# EAGLE design GNS 902 Carrier Board (EAGLE 7.4.0)
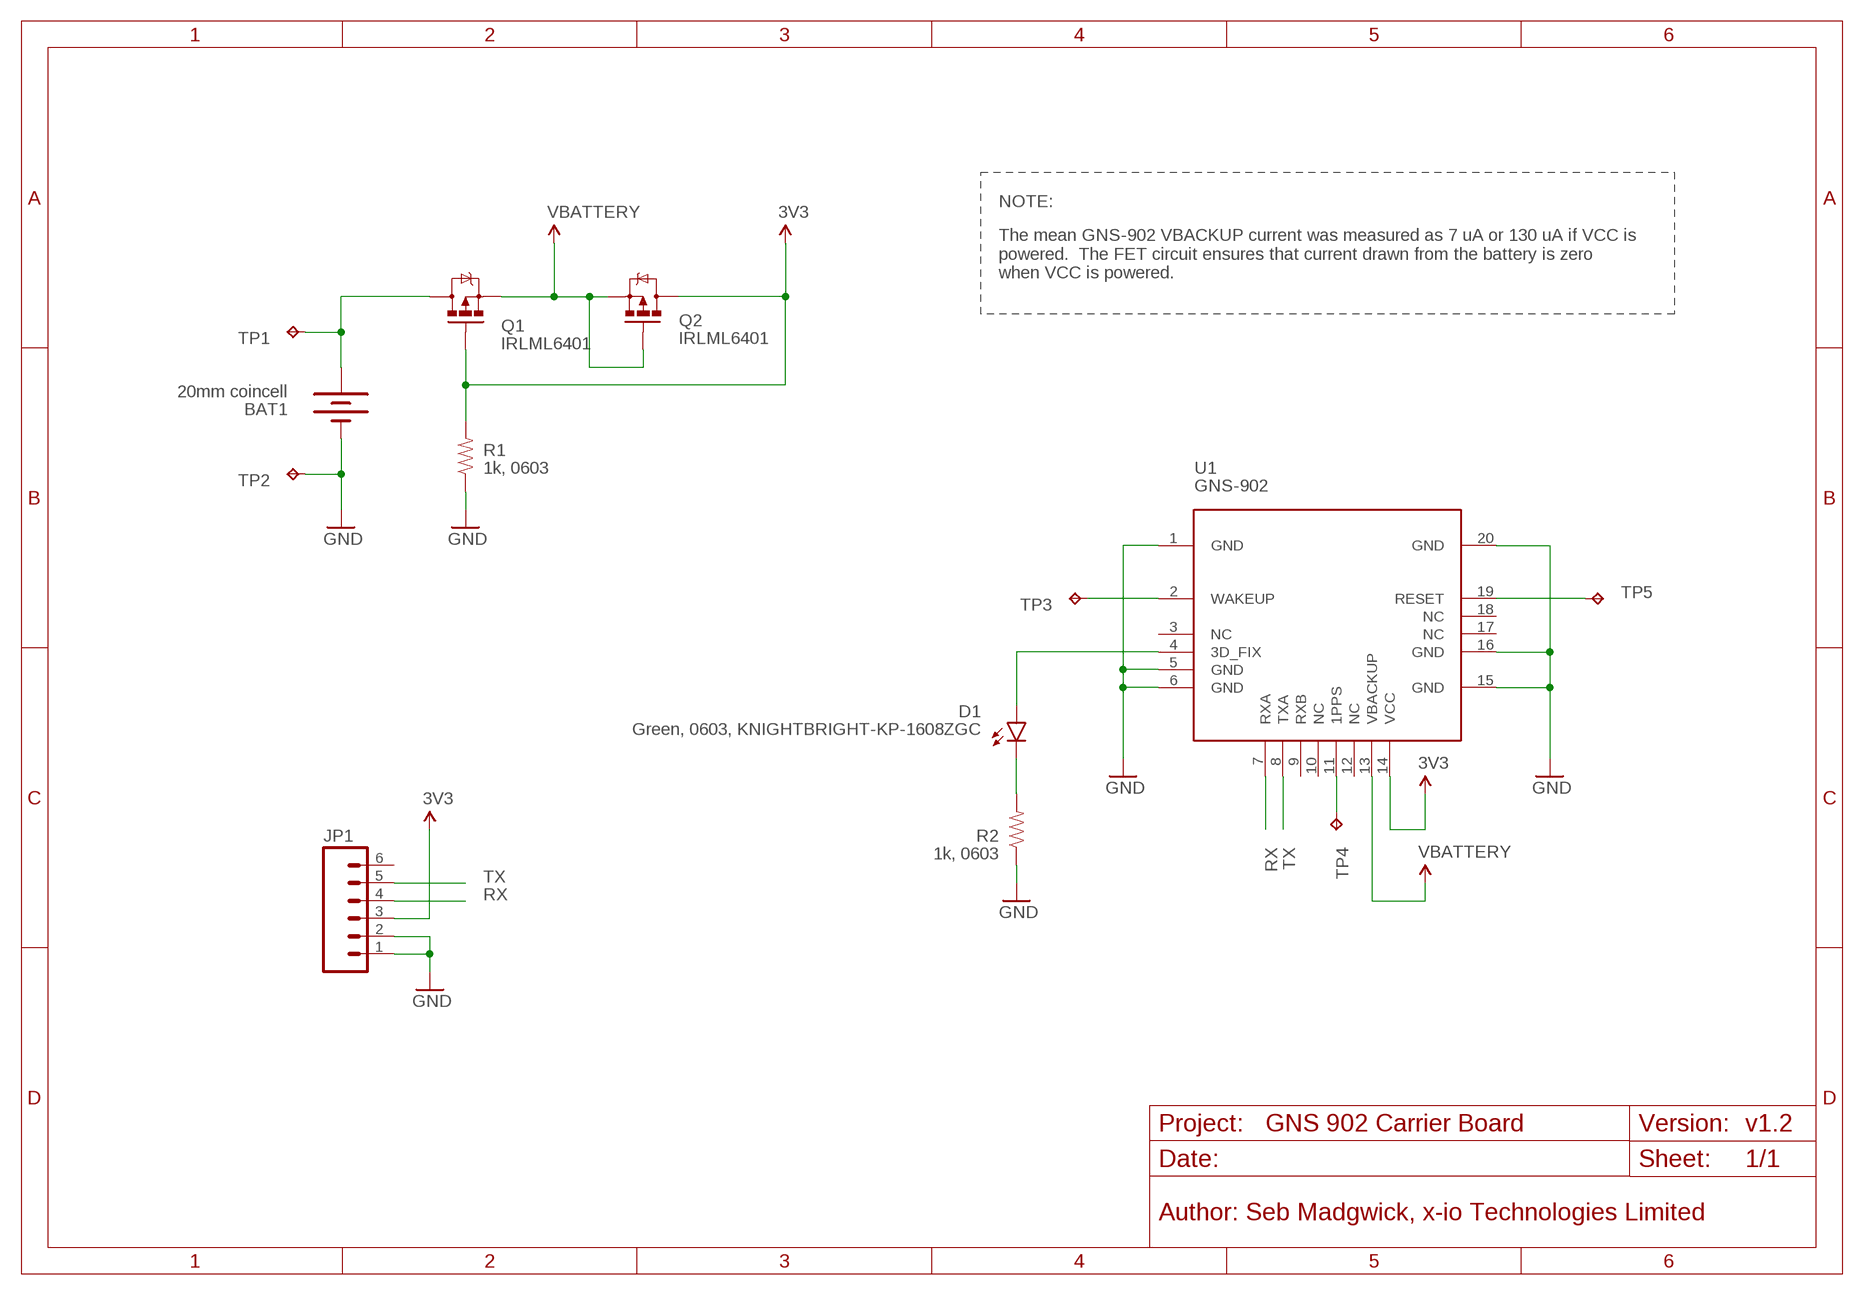
[diagram p0: schematic, sheet 1]

## Parts
BAT1  20mm coincell  BATTERY20MM_4LEGS  [BATTCON_20MM_4LEGS]
D1  Green, 0603, KNIGHTBRIGHT-KP-1608ZGC  LED0603  [LED-0603]
JP1  M06NO_SILK_FEMALE_PTH  [1X06_NO_SILK]
Q1  IRLML6401  MOSFET-PCHANNEL  [SOT23-3]
Q2  IRLML6401  MOSFET-PCHANNEL  [SOT23-3]
R1  1k, 0603  RESISTOR0603  [0603-RES]
R2  1k, 0603  RESISTOR0603  [0603-RES]
TP1  TPTP15R  [TP15R]
TP2  TPTP15R  [TP15R]
TP3  TPTP10R  [TP10R]
TP4  TPTP10R  [TP10R]
TP5  TPTP10R  [TP10R]
U1  GNS-902  [GNS-902]

## Nets
3V3: JP1.3 Q1.1(G) Q2.3(D) R1.2 U1.14(VCC)
GND: BAT1.2(-) JP1.1 JP1.2 R1.1 R2.1 TP2.TP U1.1(GND) U1.5(GND) U1.6(GND) U1.15(GND) U1.16(GND) U1.20(GND)
N$1: D1.A U1.4(3D_FIX)
N$2: D1.C R2.2
N$3: TP3.TP U1.2(WAKEUP)
N$4: TP4.TP U1.11(1PPS)
N$5: TP5.TP U1.19(RESET)
N$6: BAT1.1(+) Q1.3(D) TP1.TP
RX: JP1.4 U1.7(RXA)
TX: JP1.5 U1.8(TXA)
VBATTERY: Q1.2(S) Q2.1(G) Q2.2(S) U1.13(VBACKUP)
Unconnected: JP1.6 U1.3(NC) U1.9(RXB) U1.10(NC) U1.12(NC) U1.17(NC) U1.18(NC)

## Notes on the sheet
- NOTE:
- The mean GNS-902 VBACKUP current was measured as 7 uA or 130 uA if VCC is
  powered.  The FET circuit ensures that current drawn from the battery is zero
  when VCC is powered.
- v1.2
- Author: Seb Madgwick, x-io Technologies Limited

## Library data of the parts
BAT1 = SparkFun-Electromechanical:BATTERY: Battery Holders Various common sizes : AA, AAA, 18650 (PRT-12895), 20mm coin cell and 12mm coin cell. 20MM_4LEGS, BATT-10373; PROD_ID: BATT-10373
D1 = SparkFun-LED:LED: LEDs Standard schematic elements and footprints for 5mm, 3mm, 1206, and 0603 sized LEDs. 5mm - Spark Fun Electronics SKU : COM-00529 (and others)
JP1 = SparkFun-Connectors:M06: Header 6 Standard 6-pin 0.1" header. Use with straight break away headers (SKU : PRT-00116), right angle break away headers (PRT-00553), swiss pins (PRT-00743), machine pins (PRT-00117), and female headers (PRT-00115). Molex polarized connector foot print use with SKU : PRT-08094 with associated crimp pins and housings. NOTES ON THE VARIANTS LOCK and LOCK_LONGPADS... This footprint was designed to help hold the alignment of a through-hole component (i.e. 6-pin header) while soldering it into place. You may notice that each hole has been shifted either up or down by 0.005 of an inch from it's more standard position (which is a perfectly straight line). This slight alteration caused the pins (the squares in the middle) to touch the edges of the holes. Because they are alternating, it causes a "brace" to hold the component in place. 0.005 has proven to be the perfect amount of "off-center" position when using our standard breakaway headers. Although looks a little odd when you look at the bare footprint, once you have a header in there, the alteration is very hard to notice. Also,if you push a header all the way into place, it is covered up entirely on the bottom side. This idea of altering the position of holes to aid alignment will be further integrated into the Sparkfun Library for other footprints. It can help hold any component with 3 or more connection pins.; PROD_ID: CONN-08437
Q1 Q2 = SparkFun-DiscreteSemi:MOSFET-PCHANNEL: Generic PMOSFET IRLML2244 - TRANS-11153 (SOT-23 -20V -4.3A) (1.Gate 2.Source 3.Drain) FQP27P06 - COM-10349 <http://www.sparkfun.com/products/10349> (TO-220 -60V -27A) (1.Gate 2.Source 3.Drain); PROD_ID: TRANS-08285
R1 R2 = SparkFun-Resistors:RESISTOR: Resistor Basic schematic elements and footprints for 0603, 1206, and PTH resistors.
TP1-TP5 = testpad:TP: Test pad
U1 = x-io:GNS-902

## Board
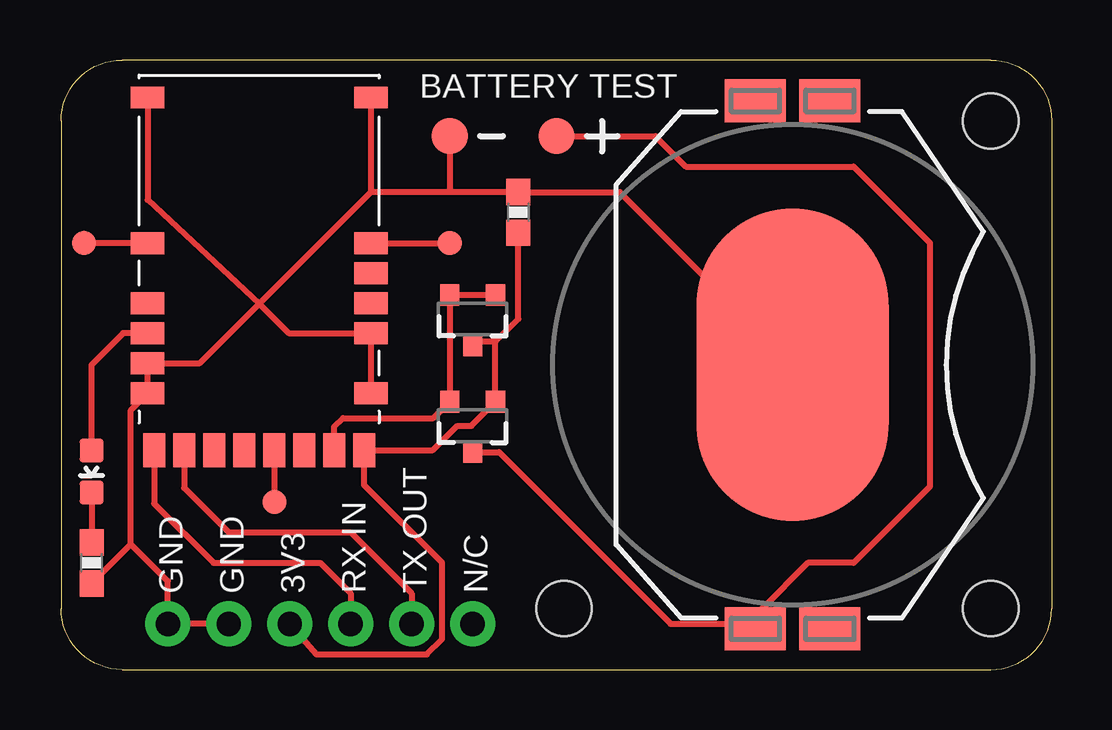
[diagram p1: board, top side]

Size 41.27 x 25.4 mm. Coordinates in mm from the lower left corner, seen from the top.
Outline: 2.54,0 38.73,0 arc90 41.27,2.54 41.27,22.86 arc90 38.73,25.4 2.54,25.4 arc90 0,22.86 0,2.54 arc90 2.54,0
Copper layers (1*16): Top 0.035mm / dielectric 1.5mm / Bottom 0.035mm
Design rules "default *": minimum track width 6mil, minimum drill 13mil, track to track 6mil, track to pad 6mil, pad to pad 6mil, via to via 6mil, smd to smd 6mil, copper to edge 15mil, drill to drill 13mil, minimum pad ring 10mil, minimum via ring 8mil, stop-mask expansion 4mil, vias tented up to drill 0mil, thermal gap 10mil
Holes 2.3 mm at 38.73,22.86 38.73,2.54 20.95,2.54

### Footprints (pad centres in the part's own frame; a part is rotated, then mirrored left to right if it is on the bottom)
BATTCON_20MM_4LEGS = smd 1.778 x 2.54: 1 -11,1.55; 3 11,1.55; P$1 -11,-1.55; P$2 11,-1.55 | smd 13 x 8: 2 0,0
LED-0603 = smd 1 x 1: A 0,-0.877; C 0,0.877
1X06_NO_SILK = drill 1.016 pad 1.88: 1 0,0; 2 2.54,0; 3 5.08,0; 4 7.62,0; 5 10.16,0; 6 12.7,0
SOT23-3 = smd 0.8 x 0.9: 1 -0.95,-1; 2 0.95,-1; 3 0,1.1
0603-RES = smd 1.1 x 1: 1 -0.85,0; 2 0.85,0
TP15R = smd 1.5 x 1.5: TP 0,0
TP10R = smd 1 x 1: TP 0,0
GNS-902 = smd 1.4 x 0.9: 1 4.65,0.925; 2 4.65,7; 3 4.65,9.5; 4 4.65,10.75; 5 4.65,12; 6 4.65,13.25; 15 -4.65,13.25; 16 -4.65,10.75; 17 -4.65,9.5; 18 -4.65,8.25; 19 -4.65,7; 20 -4.65,0.925 | smd 0.9 x 1.4: 7 4.375,15.625; 8 3.125,15.625; 9 1.875,15.625; 10 0.625,15.625; 11 -0.625,15.625; 12 -1.875,15.625; 13 -3.125,15.625; 14 -4.375,15.625

### Placement (x,y rotation side)
BAT1  30.48,12.7 90 top
D1  1.27,8.26 180 top
JP1  4.45,1.91 0 top
Q1  17.14,10.16 180 top
Q2  17.14,14.61 180 top
R1  19.05,19.05 270 top
R2  1.27,4.45 90 top
TP1  20.64,22.23 0 top
TP2  16.19,22.23 0 top
TP3  0.95,17.78 0 top
TP4  8.89,6.99 0 top
TP5  16.19,17.78 0 top
U1  8.26,24.77 180 top

### Tracks (layer width: path | path; a pad name or v marks a point on that pad's centre or on a via)
3V3
  Top 0.254: JP1.3 10.64,0.64 15.24,0.64 15.88,1.27 15.88,4.45 12.63,7.69 U1.14 15.49,9.14 16.51,10.16 17.09,10.16 Q1.1 18.09,13.65 18.1,13.65 | 18.1,13.65 17.29,13.65 Q2.3 | 18.1,13.65 19.05,14.61 R1.2
GND
  Top 0.254: 8.26,15.24 9.48,14.02 U1.16 U1.15 | 8.26,15.24 5.78,12.77 U1.5 U1.6 2.9,10.81 2.9,5.23 | 8.26,15.24 3.6,19.57 U1.1 | 8.26,15.24 12.9,19.89 12.9,20 | 2.9,5.23 R2.1 | JP1.2 JP1.1 4.45,3.69 2.9,5.23 | 16.19,19.9 R1.1 23.28,19.9 BAT1.2 | 16.19,19.9 13.01,19.9 12.9,20 | TP2.TP 16.19,19.9 | U1.20 12.9,20
N$1
  Top 0.254: D1.A 1.27,12.7 2.58,14.02 U1.4
N$2
  Top 0.254: D1.C R2.2
N$3
  Top 0.254: U1.2 0.97,17.77 TP3.TP
N$4
  Top 0.254: U1.11 TP4.TP
N$5
  Top 0.254: U1.19 16.18,17.77 TP5.TP
N$6
  Top 0.254: Q1.3 18.25,9.06 25.4,1.91 28.73,1.91 BAT1.1 29.21,1.98 29.21,2.54 31.11,4.45 33.02,4.45 36.2,7.62 36.2,17.78 33.02,20.95 26.04,20.95 24.77,22.23 TP1.TP
RX
  Top 0.254: U1.7 3.88,6.92 6.35,4.45 10.79,4.45 12.06,3.17 JP1.4
TX
  Top 0.254: U1.8 5.13,7.57 6.99,5.71 12.06,5.71 14.61,3.17 JP1.5
VBATTERY
  Top 0.254: Q2.1 Q2.2 Q1.2 15.51,10.48 11.75,10.48 11.38,10.11 U1.13

### Text on the board
_tsilk: BATTERY TEST | GND | GND | 3V3 | RX IN | TX OUT | N/C
_bsilk: GNS 902 Carrier Board | v1.2 | x-io Technologies Limited | SETTINGS LOST IF BATTERY REMOVED | WHEN POWER NOT CONNECTED. | BATTERY MUST BE >2V. | NEW BATTERY LIFE APPROX 1 YEAR.